# EAGLE design TEENSY + Sensors (EAGLE 9.6.1)
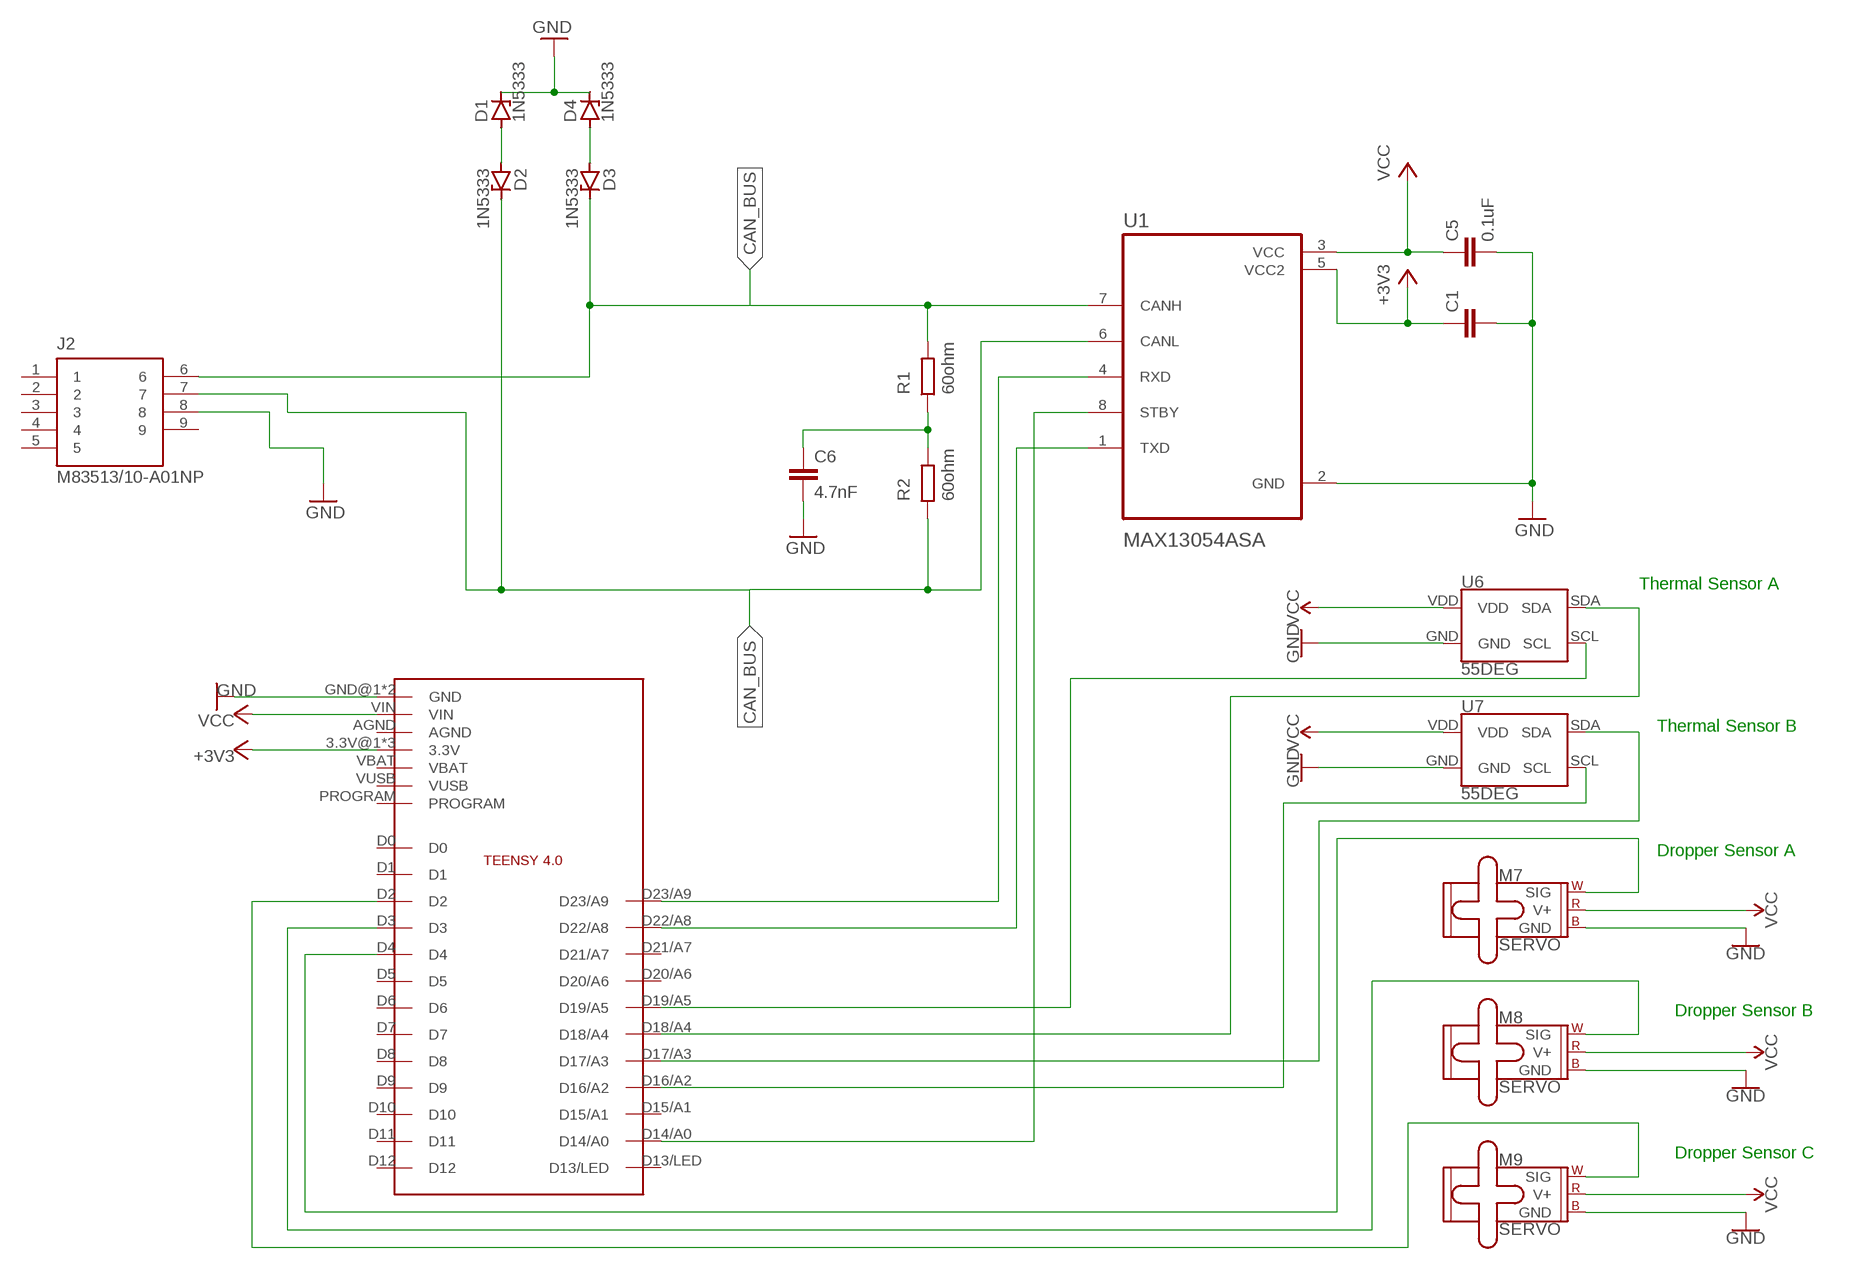
[diagram p0: schematic, sheet 1]

## Parts
C1  C2,5-3  [C2.5-3]
C5  0.1uF  C2,5-3  [C2.5-3]
C6  4.7nF  C2,5-3  [C2.5-3]
D1  1N5333  [C1702-15]
D2  1N5333  [C1702-15]
D3  1N5333  [C1702-15]
D4  1N5333  [C1702-15]
J2  M83513/10-A01NP  [BEL_M83513/10-A01NP]
M7  SERVO  [1X03]
M8  SERVO  [1X03]
M9  SERVO  [1X03]
R1  60ohm  R  (no package)
R2  60ohm  R  (no package)
U1  MAX13054ASA  [SOIC127P600X175-8N]
U6  55DEG  MLX90540_MLX90640  [MLX90540_MLX90640]
U7  55DEG  MLX90540_MLX90640  [MLX90540_MLX90640]
U$2  TEENSY4.0  [TEENSY4.0]

## Nets
+3V3: C1.1 U1.5(VCC2) U$2.3.3V@1(3.3V) U$2.3.3V@2(3.3V) U$2.ON/OFF(3.3V)
CAN_BUS: D3.C J2.6 R1.2 U1.7(CANH)
GND: C1.2 C5.2 C6.2 D1.C D4.C J2.8 M7.3(GND) M8.3(GND) M9.3(GND) U1.2(GND) U6.GND U7.GND U$2.GND@1(GND) U$2.GND@2(GND)
N$1: U1.4(RXD) U$2.D23/A9
N$2: U1.1(TXD) U$2.D22/A8
N$4: D1.A D2.A
N$5: D2.C J2.7 R2.1 U1.6(CANL)
N$6: C6.1 R1.1 R2.2
N$7: D3.A D4.A
N$46: U1.8(STBY) U$2.D14/A0
N$48: U7.SDA U$2.D17/A3
N$49: U7.SCL U$2.D16/A2
N$50: M7.1(SIG) U$2.D4
N$51: M8.1(SIG) U$2.D3
N$52: M9.1(SIG) U$2.D2
N$53: U6.SCL U$2.D19/A5
N$55: U6.SDA U$2.D18/A4
VCC: C5.1 M7.2(V+) M8.2(V+) M9.2(V+) U1.3(VCC) U6.VDD U7.VDD U$2.VIN
Unconnected: J2.1 J2.2 J2.3 J2.4 J2.5 J2.9 U$2.AGND U$2.D0 U$2.D1 U$2.D5 U$2.D6 U$2.D7 U$2.D8 U$2.D9 U$2.D10 U$2.D11 U$2.D12 U$2.D13/LED U$2.D15/A1 U$2.D20/A6 U$2.D21/A7 U$2.PROGRAM U$2.VBAT U$2.VUSB

## Notes on the sheet
- Thermal Sensor A
- Thermal Sensor B
- Dropper Sensor A
- Dropper Sensor B
- Dropper Sensor C

## Library data of the parts
C1 C5 C6 = capacitor-wima:C: CAPACITOR naming: grid - package width
D1-D4 = diode:1N5333: Z DIODE 3.3 V, 5W, 5 percent (Motorola)
J2 = M83513_10-A01NP:M83513/10-A01NP: MIL-DTL-83513 PCB Mounted Connector | Plug | 9 Positions | Shell Finish - Cadmium | Male | PCB Solder Pins | 0.109in (2.77 mm) Pin Length; AVAILABILITY: Unavailable; DESCRIPTION: MIL-DTL-83513 PCB Mounted Connector | Plug | 9 Positions | Shell Finish - Nickel | Male | PCB Solder Pins | 0.109 (2.77 mm) Pin Length | Jackpost Attached; MF: Cinch Connectivity Solutions; MP: M83513/10-A01NP; PACKAGE: None; PRICE: None
M7-M9 = SparkFun-Electromechanical:SERVO: Servo Motor 3-pin connector for a standard servo motor (voltage supply, ground, and control signal.) SparkFun Products Servo - Generic (Sub-Micro Size) <https://www.sparkfun.com/products/9065> (ROB-09065) Servo - Generic High Torque Continuous Rotation (Standard Size) <https://www.sparkfun.com/products/9347> (ROB-09347) Servo - Generic High Torque (Standard Size) <https://www.sparkfun.com/products/11965> (ROB-11965)
R1 R2 = ngspice-simulation:R: RESISTOR
U1 = MAX13054ASA:MAX13054ASA; DESCRIPTION: 1/1 Transceiver Full CANbus 8-SOIC; DIGI-KEY_PART_NUMBER: MAX13054ASA+TTR-ND; DIGI-KEY_PURCHASE_URL: https://www.digikey.com/product-detail/en/maxim-integrated/MAX13054ASA-T/MAX13054ASA-TTR-ND/1475460?utm_source=snapeda&utm_medium=aggregator&utm_campaign=symbol; MF: Maxim Integrated; MP: MAX13054ASA+; PACKAGE: SOIC-8 Maxim
U6 U7 = SparkFun-IC-Special-Function:MLX90540_MLX90640: Melexis MLX90640 Infrared Array The MLX90640 is a fully calibrated 32x24 pixels thermal IR array in an industry standard 4-lead TO39 package with digital interface.; PROD_ID: IC-14042
U$2 = Teensy4.0:TEENSY4.0

## Module RESISTER
Ports: 

### Library data of the parts

## Module GND
Ports: 

### Library data of the parts

## Module MOTOR
Ports: 

### Library data of the parts

## Module MOTORDRIVER
Ports: U(io) V(io) W(io) VCC(io) GND(io) 5V(io) GND1(io) HA(io) HB(io) HC(io) RS232(io) PWR(io) ALM(io) GND2(io) ALM1(io) X3(io) PG(io) X2(io) 5V1(io) X1(io) 5V2(io) PR(io) GND3(io) EN(io) BR(io)

### Library data of the parts

## Net classes
0 default: width 0.305 mm, drill 0.508 mm, clearance 0.254 mm

## Board
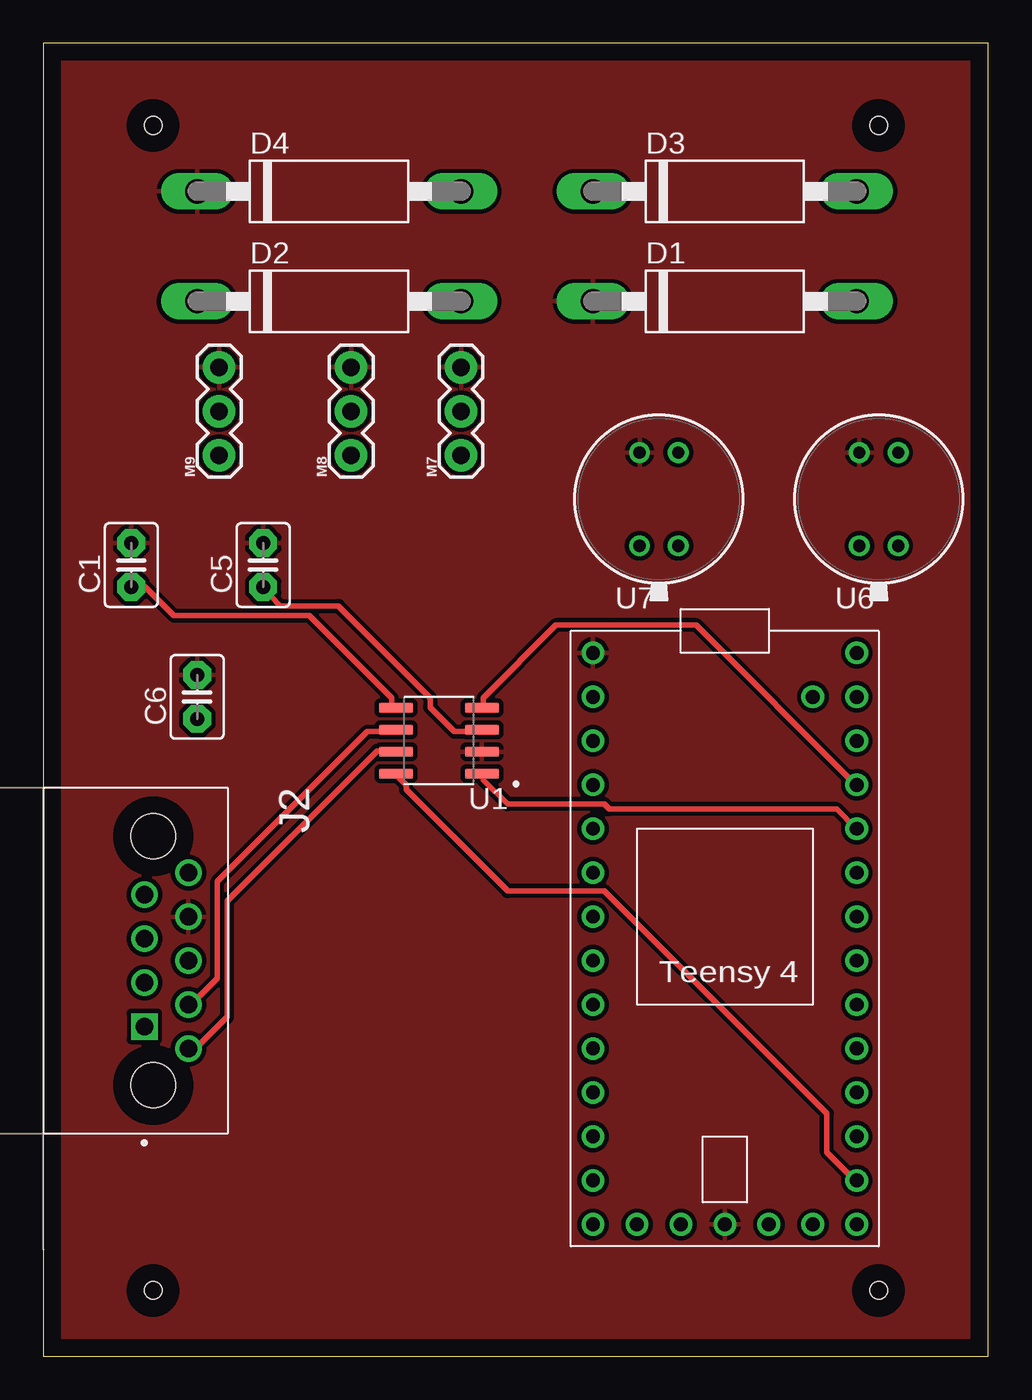
[diagram p1: board, top side]
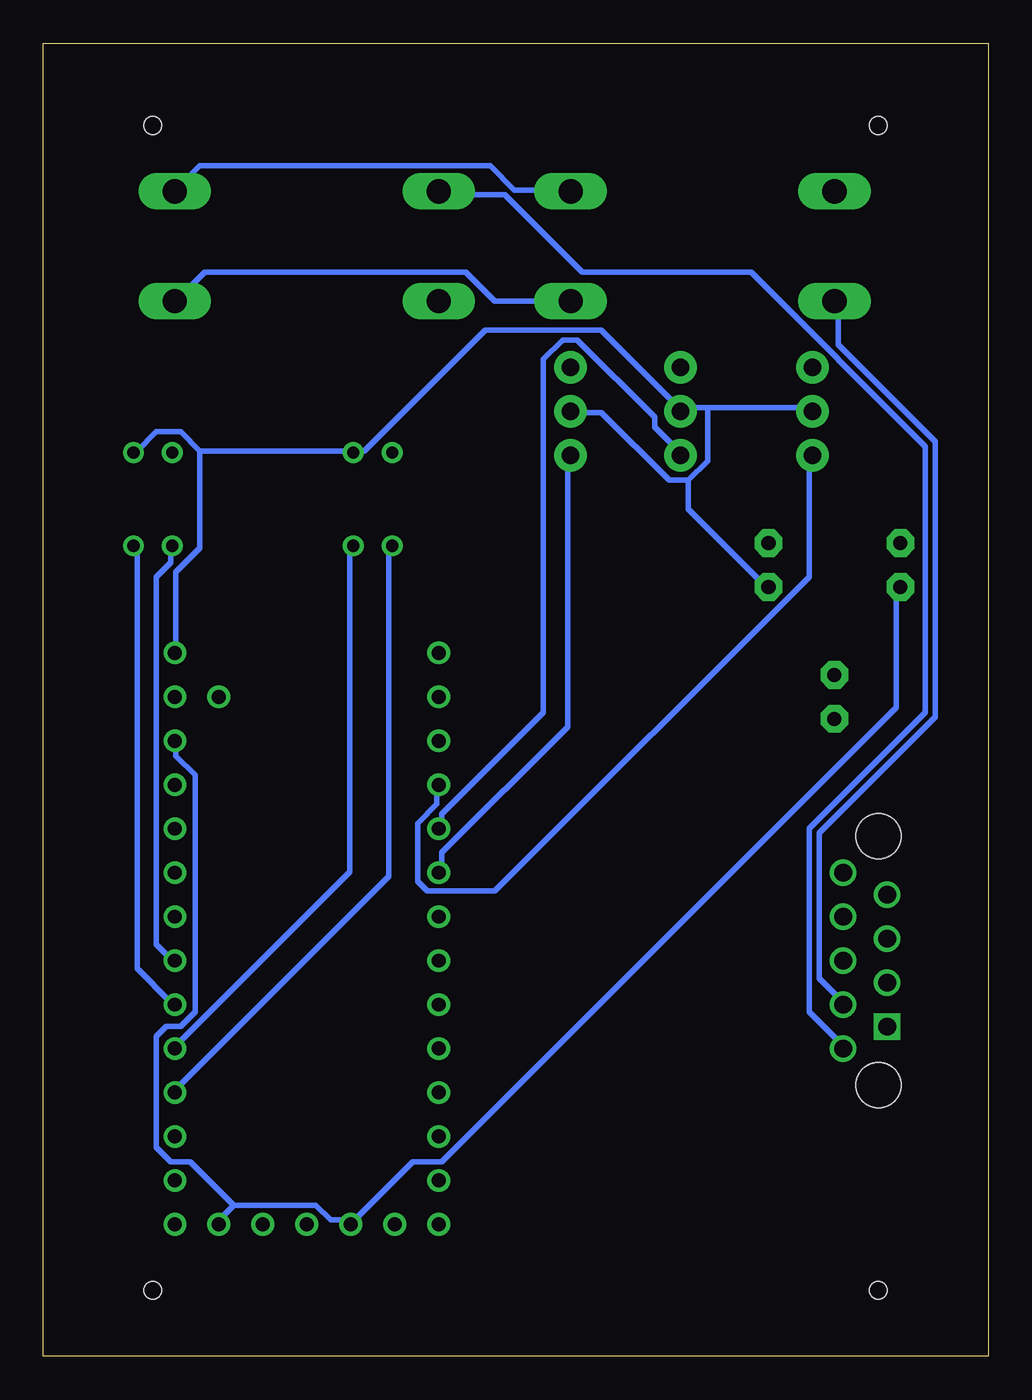
[diagram p2: board, bottom side, seen from below]

Size 54.59 x 75.87 mm. Coordinates in mm from the lower left corner, seen from the top.
Outline: 0,0 54.59,0 54.59,75.87 0,75.87 0,0
Copper layers (1*16): Top 0.035mm / dielectric 1.5mm / Bottom 0.035mm
Design rules "default": minimum track width 6mil, minimum drill 0.35mm, track to track 6mil, track to pad 6mil, pad to pad 6mil, via to via 6mil, smd to smd 6mil, copper to edge 40mil, drill to drill 6mil, minimum pad ring 10mil, minimum via ring 8mil, stop-mask expansion 4mil, vias tented up to drill 0mil, thermal gap 10mil
Holes 1 mm at 6.35,3.81 48.26,3.81 6.35,71.12 48.26,71.12

### Footprints (pad centres in the part's own frame; a part is rotated, then mirrored left to right if it is on the bottom)
C2.5-3 = drill 0.813 pad 1.6 octagon: 1 -1.27,0; 2 1.27,0
C1702-15 = drill 1.397 long: A 7.62,0; C -7.62,0
BEL_M83513/10-A01NP = drill 1.02 square: 1 3.81,-0.508 | drill 1.02: 2 1.27,-0.508; 3 0,2.032; 4 -1.27,-0.508; 5 -3.81,-0.508; 6 5.08,2.032; 7 2.54,2.032; 8 -2.54,2.032; 9 -5.08,2.032 | hole 2.57: -7.188,0; 7.188,0
1X03 = drill 1.016 pad 1.88: 1 0,0; 2 2.54,0; 3 5.08,0
SOIC127P600X175-8N = smd 1.97 x 0.59: 1 -2.475,1.905; 2 -2.475,0.635; 3 -2.475,-0.635; 4 -2.475,-1.905; 5 2.475,-1.905; 6 2.475,-0.635; 7 2.475,0.635; 8 2.475,1.905
MLX90540_MLX90640 = drill 0.7: GND -1.117,2.698; SCL -1.117,-2.698; SDA 1.117,-2.698; VDD 1.117,2.698
TEENSY4.0 = drill 0.8: 3.3V@1 7.62,10.16; 3.3V@2 -2.54,-17.78; AGND 7.62,12.7; D0 -7.62,12.7; D1 -7.62,10.16; D2 -7.62,7.62; D3 -7.62,5.08; D4 -7.62,2.54; D5 -7.62,0; D6 -7.62,-2.54; D7 -7.62,-5.08; D8 -7.62,-7.62; D9 -7.62,-10.16; D10 -7.62,-12.7; D11 -7.62,-15.24; D12 -7.62,-17.78; D13/LED 7.62,-17.78; D14/A0 7.62,-15.24; D15/A1 7.62,-12.7; D16/A2 7.62,-10.16; D17/A3 7.62,-7.62; D18/A4 7.62,-5.08; D19/A5 7.62,-2.54; D20/A6 7.62,0; D21/A7 7.62,2.54; D22/A8 7.62,5.08; D23/A9 7.62,7.62; GND@1 -7.62,15.24; GND@2 0,-17.78; ON/OFF 5.08,-17.78; PROGRAM 2.54,-17.78; VBAT -5.08,-17.78; VIN 7.62,15.24; VUSB 5.08,12.7

### Placement (x,y rotation side)
C1  5.08,45.72 90 top
C5  12.7,45.72 90 top
C6  8.89,38.1 90 top
D1  39.37,60.96 0 top
D2  16.51,60.96 0 top
D3  39.37,67.31 0 top
D4  16.51,67.31 0 top
J2  6.35,22.86 270 top
M7  24.13,52.07 90 top
M8  17.78,52.07 90 top
M9  10.16,52.07 90 top
U1  22.86,35.56 180 top
U6  48.26,49.53 0 top
U7  35.56,49.53 0 top
U$2  39.37,25.4 0 top

### Tracks (layer width: path | path; a pad name or v marks a point on that pad's centre or on a via)
+3V3
  Top 0.305: U1.5 20.12,37.49 20.12,38.05 15.37,42.8 7.54,42.8 5.87,44.48 5.31,44.48 C1.1
  Bottom 0.305: 43.59,8.71 38.84,8.71 38,7.87 36.88,7.87 U$2.3.3V@2 36.6,7.87 33.25,11.23 31.57,11.23 5.31,37.49 5.31,44.2 C1.1 | 43.59,8.71 44.42,7.87 U$2.ON/OFF | 43.59,8.71 46.1,11.23 47.22,11.23 48.06,12.07 48.06,18.49 47.5,19.05 46.66,19.05 45.82,19.89 45.82,33.58 46.94,34.7 46.94,35.53 U$2.3.3V@1
CAN_BUS
  Top 0.305: U1.7 20.12,34.98 19.28,34.98 10.62,26.31 10.62,19.61 8.94,17.93 8.38,17.93 J2.6
  Bottom 0.305: D3.C 31.57,67.11 27.94,67.11 23.47,62.64 13.69,62.64 3.63,52.58 3.63,37.21 10.34,30.51 10.34,19.89 8.38,17.93 J2.6
GND
  pour Top: -1.27,77.47 -1.27,0 55.88,0 55.88,77.47
N$1
  Top 0.305: U1.4 25.43,37.49 25.43,38.05 29.62,42.24 37.72,42.24 46.94,33.02 U$2.D23/A9
N$2
  Top 0.305: U1.1 25.43,33.58 25.43,33.3 26.82,31.9 32.41,31.9 32.69,31.62 45.82,31.62 46.94,30.51 U$2.D22/A8
N$4
  Bottom 0.305: D2.A 28.5,60.96 30.18,62.64 45.26,62.64 46.94,60.96 D1.A
N$5
  Top 0.305: U1.6 20.12,36.09 18.72,36.09 10.06,27.43 10.06,21.84 8.38,20.17 J2.7
  Bottom 0.305: D2.C 8.66,60.96 8.66,58.45 3.07,52.86 3.07,36.93 9.78,30.23 9.78,21.84 8.38,20.45 J2.7
N$7
  Bottom 0.305: D4.A 24.31,67.39 27.38,67.39 28.78,68.78 45.54,68.78 46.94,67.39 D3.A
N$46
  Top 0.305: U1.8 20.4,33.58 20.95,33.02 20.95,32.74 26.82,26.87 32.41,26.87 45.26,14.02 45.26,11.79 46.94,10.11 U$2.D14/A0
N$48
  Bottom 0.305: U7.SDA 36.88,46.71 36.88,27.99 46.94,17.93 U$2.D17/A3
N$49
  Bottom 0.305: U7.SCL 34.65,46.71 34.65,27.71 46.94,15.42 U$2.D16/A2
N$50
  Bottom 0.305: U$2.D4 31.57,27.99 31.57,29.11 24.31,36.37 24.31,52.02 M7.1
N$51
  Bottom 0.305: U$2.D3 31.57,30.51 31.57,31.34 25.7,37.21 25.7,57.61 24.59,58.73 23.75,58.73 19.28,54.25 19.28,53.7 17.88,52.3 M8.1
N$52
  Bottom 0.305: U$2.D2 31.85,33.02 31.85,31.9 32.97,30.78 32.97,27.43 32.41,26.87 28.5,26.87 10.34,45.03 10.34,52.02 M9.1
N$53
  Bottom 0.305: U6.SCL 47.22,46.71 47.22,45.87 48.06,45.03 48.06,23.8 47.22,22.96 U$2.D19/A5
N$55
  Bottom 0.305: U6.SDA 49.17,46.71 49.17,22.4 47.22,20.45 U$2.D18/A4
VCC
  Top 0.305: U1.3 25.15,36.09 23.75,36.09 22.35,37.49 22.35,38.05 17.04,43.36 13.69,43.36 13.13,43.92 12.85,43.92 12.57,44.2 C5.1
  Bottom 0.305: 45.54,52.3 36.88,52.3 U7.VDD 36.6,52.3 36.04,52.3 29.06,59.28 22.35,59.28 17.88,54.81 M8.2 17.6,54.81 16.2,54.81 | 45.54,52.3 46.66,53.42 48.06,53.42 49.17,52.3 U6.VDD | 45.54,52.3 45.54,46.71 46.94,45.31 46.94,40.84 U$2.VIN | 16.2,54.81 10.34,54.81 M9.2 | 17.32,50.62 18.44,50.62 22.35,54.53 24.03,54.53 M7.2 | 17.32,50.62 16.2,51.74 16.2,54.81 | 17.32,50.62 17.32,48.95 12.85,44.48 C5.1